# Altium schematic sheet BLDC-DRIVER.SchDoc
size 420 x 297 mm; DocumentNumber: АБВГ.000000.000 Э3; SheetNumber: 2; PageSetup: Record=PageOptions|CenterHorizontal=False|CenterVertical=False|PrintScale=0.95|XCorrection=0.00|YCorrection=0.00|PrintKind=1|BorderSize=5000000|LeftOffset=0|BottomOffset=0|Orientation=1|PaperLength=1000|PaperWidth=1000|Scale=100|PaperSource=15|PrintQuality=600|MediaType=1|DitherType=10|PaperKind=A4|PrintScaleMode=1; Letter1Column: {}; Letter2Column: {}; Letter3Column: {}; ProcessInspection: ProcessInspection; EngineerName: EngineerName; NormInspection: NormInspection; DocumentType: DocumentType; Mass: Mass; Scale: Scale; Developer1size1str: Developer1size1str; Developer2size1str: Developer2size1str; Developer2size2str: Developer2size2str; Title1size1str: Title1size1str; Title2size1str: Title2size1str; Title2size2str: Title2size2str; Title3size3str: Title3size3str; Title3size2str: Title3size2str; Title3size1str: Title3size1str; FunctionalGroup: #_
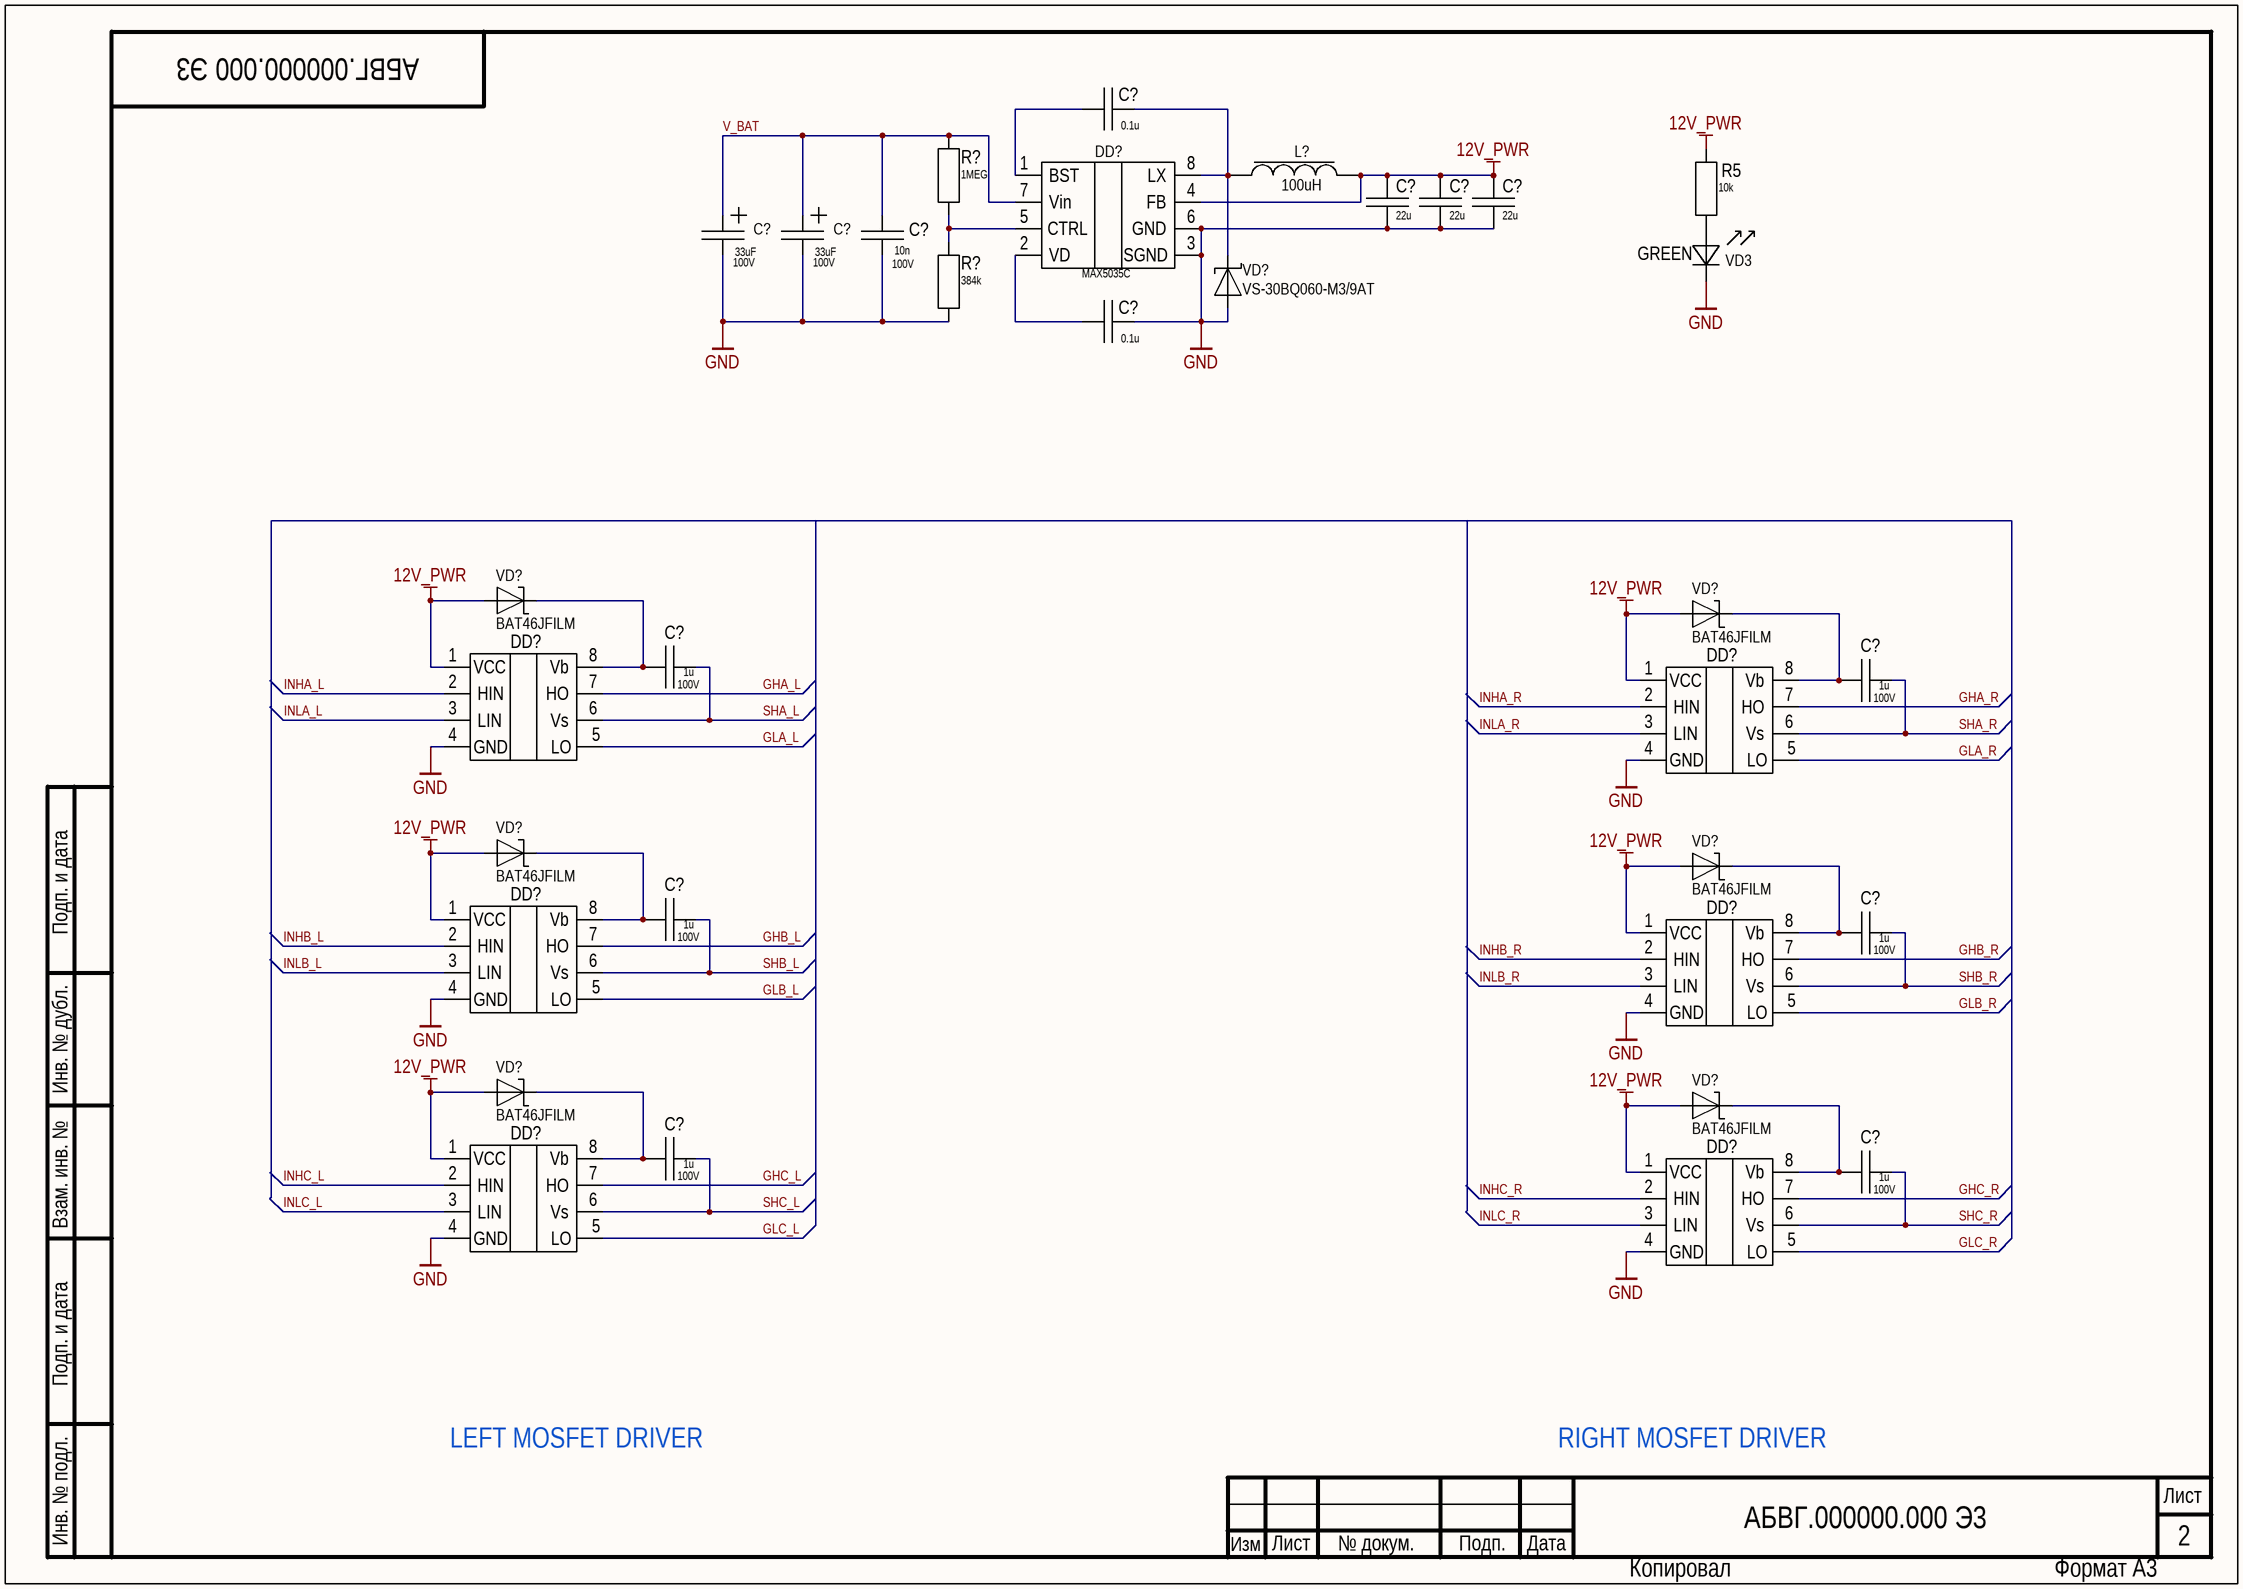
[diagram p0: BLDC-DRIVER.SchDoc]

## Parts
(Parts that share a designator on the sheet are numbered #1, #2 ... from top to bottom, then left to right.)
C?#1  0.1u  [CAP: 0402]
C?#2  value 33uF  Voltage: 100V  [ECR08]  (hidden comment: ECR0812)
C?#3  value 33uF  Voltage: 100V  [ECR08]  (hidden comment: ECR0812)
C?#4  value 10n  Voltage: 100V  [CAP: 0603]
C?#5  22u  [CAP: 0805]
C?#6  22u  [CAP: 0805]
C?#7  22u  [CAP: 0805]
C?#8  0.1u  [CAP: 0402]
C?#9  Voltage: 100V  [CAP: 0603]  (hidden comment: 1u)
C?#10  Voltage: 100V  [CAP: 0603]  (hidden comment: 1u)
C?#11  Voltage: 100V  [CAP: 0603]  (hidden comment: 1u)
C?#12  Voltage: 100V  [CAP: 0603]  (hidden comment: 1u)
C?#13  Voltage: 100V  [CAP: 0603]  (hidden comment: 1u)
C?#14  Voltage: 100V  [CAP: 0603]  (hidden comment: 1u)
DD?#1  MAX5035C  [SOIC-8-150-1.27]
DD?#2  FAN7842MX  [SOIC-8-150-1.27]  (value not drawn)
DD?#3  FAN7842MX  [SOIC-8-150-1.27]  (value not drawn)
DD?#4  FAN7842MX  [SOIC-8-150-1.27]  (value not drawn)
DD?#5  FAN7842MX  [SOIC-8-150-1.27]  (value not drawn)
DD?#6  FAN7842MX  [SOIC-8-150-1.27]  (value not drawn)
DD?#7  FAN7842MX  [SOIC-8-150-1.27]  (value not drawn)
L?  value 100uH  [IND: SRR1208]
R5  10k  [RES: 0402]
R?#1  1MEG  [RES: 0402]
R?#2  384k  [RES: 0402]
VD3  value GREEN  [LED: 0402G]  (hidden comment: Led 0402 GREEN)
VD?#1  PartNumber: VS-30BQ060-M3/9AT  [DIODE: SMC]
VD?#2  PartNumber: BAT46JFILM  [DIODE: SOD323]
VD?#3  PartNumber: BAT46JFILM  [DIODE: SOD323]
VD?#4  PartNumber: BAT46JFILM  [DIODE: SOD323]
VD?#5  PartNumber: BAT46JFILM  [DIODE: SOD323]
VD?#6  PartNumber: BAT46JFILM  [DIODE: SOD323]
VD?#7  PartNumber: BAT46JFILM  [DIODE: SOD323]

## Nets
12V_PWR: C?#5.2 C?#6.2 C?#7.2 DD?#1.4(FB) DD?#2.1(VCC) DD?#3.1(VCC) DD?#4.1(VCC) DD?#5.1(VCC) DD?#6.1(VCC) DD?#7.1(VCC) L?.1 R5.2 VD?#2.1 VD?#3.1 VD?#4.1 VD?#5.1 VD?#6.1 VD?#7.1
GND: C?#2.2 C?#3.2 C?#4.1 C?#5.1 C?#6.1 C?#7.1 C?#8.1 DD?#1.3(SGND) DD?#1.6(GND) DD?#2.4(GND) DD?#3.4(GND) DD?#4.4(GND) DD?#5.4(GND) DD?#6.4(GND) DD?#7.4(GND) R?#2.1 VD3.2 VD?#1.1
GHA_L: DD?#2.7(HO)
GHA_R: DD?#3.7(HO)
GHB_L: DD?#4.7(HO)
GHB_R: DD?#5.7(HO)
GHC_L: DD?#6.7(HO)
GHC_R: DD?#7.7(HO)
GLA_L: DD?#2.5(LO)
GLA_R: DD?#3.5(LO)
GLB_L: DD?#4.5(LO)
GLB_R: DD?#5.5(LO)
GLC_L: DD?#6.5(LO)
GLC_R: DD?#7.5(LO)
INHA_L: DD?#2.2(HIN)
INHA_R: DD?#3.2(HIN)
INHB_L: DD?#4.2(HIN)
INHB_R: DD?#5.2(HIN)
INHC_L: DD?#6.2(HIN)
INHC_R: DD?#7.2(HIN)
INLA_L: DD?#2.3(LIN)
INLA_R: DD?#3.3(LIN)
INLB_L: DD?#4.3(LIN)
INLB_R: DD?#5.3(LIN)
INLC_L: DD?#6.3(LIN)
INLC_R: DD?#7.3(LIN)
SHA_L: C?#9.2 DD?#2.6(Vs)
SHA_R: C?#10.2 DD?#3.6(Vs)
SHB_L: C?#11.2 DD?#4.6(Vs)
SHB_R: C?#12.2 DD?#5.6(Vs)
SHC_L: C?#13.2 DD?#6.6(Vs)
SHC_R: C?#14.2 DD?#7.6(Vs)
V_BAT: C?#2.1 C?#3.1 C?#4.2 DD?#1.7(Vin) R?#1.2
NetC?#1_1: C?#1.1 DD?#1.8(LX) L?.2 VD?#1.2
NetC?#1_2: C?#1.2 DD?#1.1(BST)
NetC?#8_2: C?#8.2 DD?#1.2(VD)
NetC?#9_1: C?#9.1 DD?#2.8(Vb) VD?#2.2
NetC?#10_1: C?#10.1 DD?#3.8(Vb) VD?#3.2
NetC?#11_1: C?#11.1 DD?#4.8(Vb) VD?#4.2
NetC?#12_1: C?#12.1 DD?#5.8(Vb) VD?#5.2
NetC?#13_1: C?#13.1 DD?#6.8(Vb) VD?#6.2
NetC?#14_1: C?#14.1 DD?#7.8(Vb) VD?#7.2
NetDD?#1_5: DD?#1.5(CTRL) R?#1.1 R?#2.2
NetR5_1: R5.1 VD3.1

## Notes on the sheet
- LEFT MOSFET DRIVER
- RIGHT MOSFET DRIVER
- Подп. и дата
- Инв. № дубл.
- Взам. инв. №
- Инв. № подл.
- Лист
- Изм
- № докум.
- Подп.
- Дата
- Копировал
- Формат А3

## Library data of the parts
C?#1 C?#8 = CAP 0402: Manufacturer: Kemet; Voltage: 100V; Type: Capacitor; Temperature_Range: -55/+85; Tolerance: 10%; Value: 0.1u; Case: 0402
C?#2 C?#3 = ECR0812: PartNumber: JRB2A330M03500800120000B; Case: 8x12; Link: https://www.chipdip.by/product0/9000565862
C?#4 = Ceramic_0603: Manufacturer: murata; PartNumber: GRM188R72A103KA01D; ValueManufacturerPartNumber: Ceramic capacitor, 10n, X7R, ±10%, 100V, 0603, -55...+125°C; TypeCapacitor: Ceramic capacitor; Tolerance: ±10%; TypeDielectric: X7R; Package: 0603; HelpURL: https://www.chipdip.by/product/grm188r72a103ka01d; Temperature: -55...+125°C
C?#5-C?#7 = CAP 0805: PartNumber: GRM21BR60J226M*; Voltage: 6.3V; Value: 22u
C?#9-C?#14 = CAP 0603: PartNumber: *; Case: 0603; Tolerance: *; ComponentLink1Description: Mouser; ComponentLink1URL: *; Value: 1u
DD?#1 = MAX5035*
L? = Inductor_SRR1208: Manufacturer: EPCOS; PartNumber: B82477G4104M000; TypeInductor: Fixed inductor; MaxCurrent: 1.7A; Tolerance: 20%; Link: https://www.chipdip.by/product/b82477g4104m; Temperature: -40...+150°C
R5 = RES 0402: Tolerance: 1%; PartNumber: *; Value: 10k
R?#1 R?#2 = RES 0402: PartNumber: RC0402FR-1339K2L; Tolerance: 1%; Manufacturer: *; Type: Resistor; Temperature_Range: *; Composition: *; Voltage: *; Case: 0402
  R?#1: Value: 1MEG
  R?#2: Value: 384k
VD?#1-VD?#7 = Schottky_single: Manufacturer: Diodes Incorporated; ValueManufacturerPartNumber: Schottky diode, 80V, 500mA, 1V, 15pF, SOD-123, -55...+150°C; TypeDiode: Schottky diode; Voltage: 80V; Current: 500mA; VoltageDrop: 1V; RecoveryTime: 15pF; Package: SOD-123; HelpURL: https://www.digikey.com/product-detail/en/diodes-incorporated/MBR0580S1-7/MBR0580S1-7DICT-ND/5080371; Temperature: -55...+150°C